# EasyEDA Pro project MSDRV4.eprj, schematic MAX2831_2024_REUSE
Board Name: MAX2831_2024_REUSE; Create Date: 2025-01-27; Page Name: P1; Project Name: MSDRV4; Schematic Name: MAX2831_2024_REUSE; Update Date: 2025-01-27; Company: EasyEDA.com; Page Size: A4; Version: V1.0
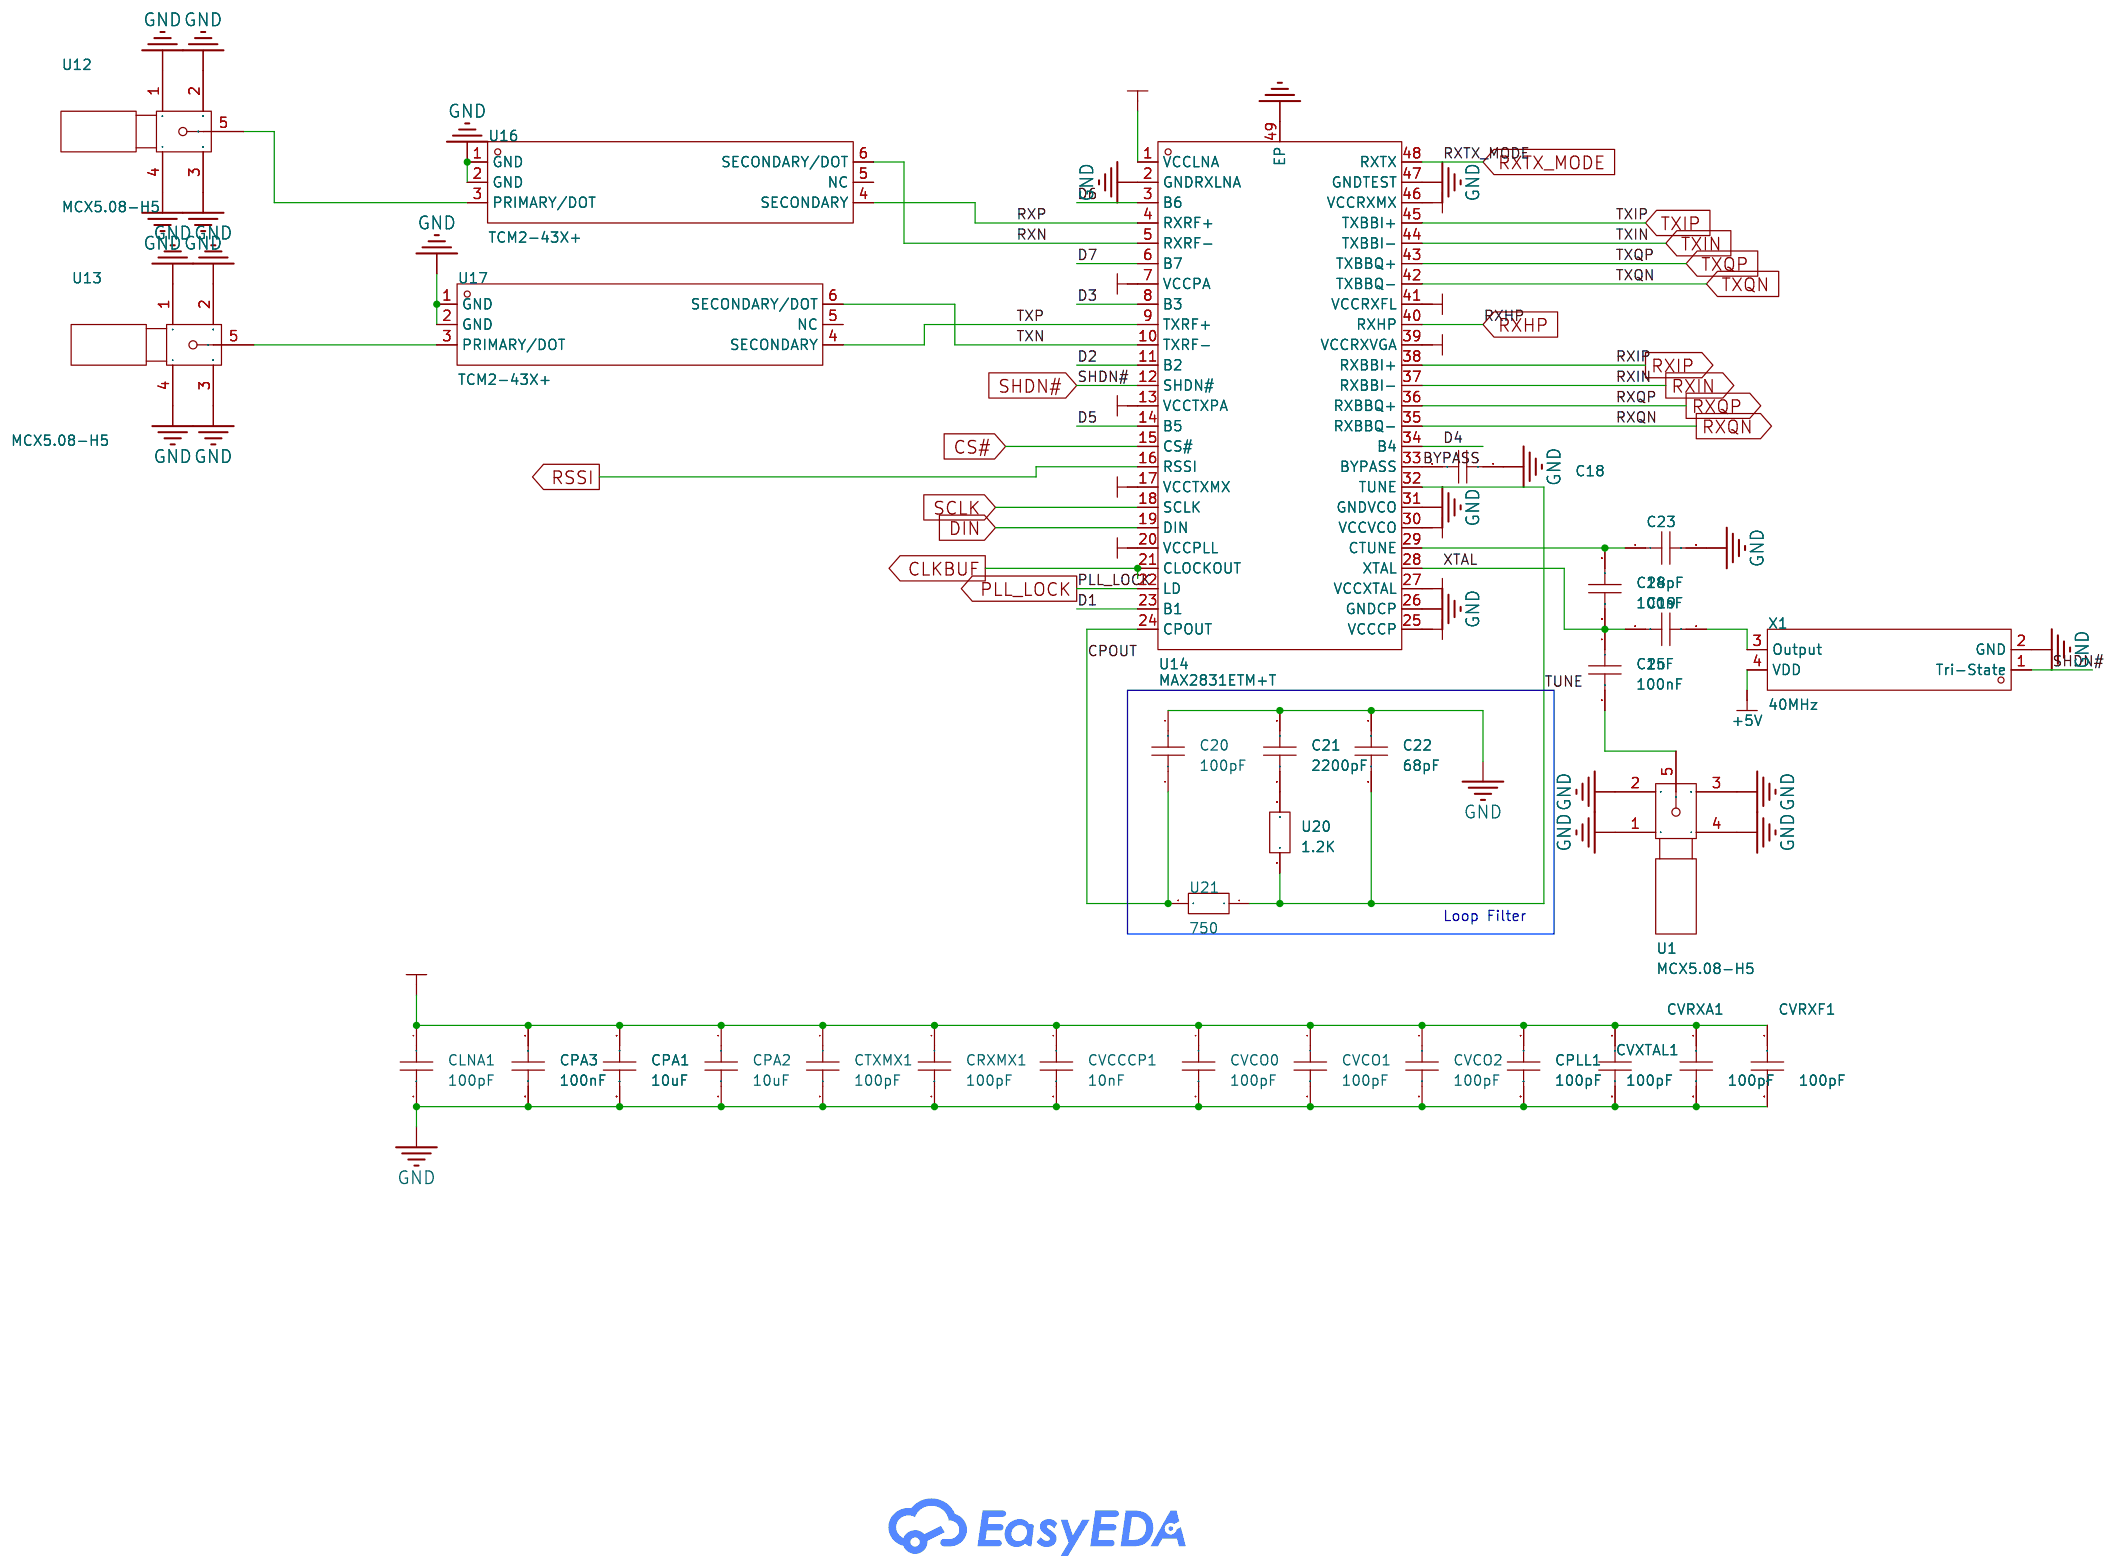
[diagram p2: schematic sheet]

## Parts
C18  100nF  [C0805]
C19  1nF  [C0805]
C20  100pF  [C0805]
C21  2200pF  [C0805]
C22  68pF  [C0805]
C23  18pF  [C0805]
C24  100nF  [C0805]
C25  100nF  [C0805]
CLNA1  100pF  [C0805]
CPA1  10uF  [C0805]
CPA2  10uF  [C0805]
CPA3  100nF  [C0805]
CPLL1  100pF  [C0805]
CRXMX1  100pF  [C0805]
CTXMX1  100pF  [C0805]
CVCCCP1  10nF  [C0805]
CVCO0  100pF  [C0805]
CVCO1  100pF  [C0805]
CVCO2  100pF  [C0805]
CVRXA1  100pF  [C0805]
CVRXF1  100pF  [C0805]
CVXTAL1  100pF  [C0805]
U1  MCX5.08-H5  [SMA-TH_MCX5.08-H5]
U12  MCX5.08-H5  [SMA-TH_MCX5.08-H5]
U13  MCX5.08-H5  [SMA-TH_MCX5.08-H5]
U14  MAX2831ETM+T  [TQFN-48_L7.0-W7.0-P0.50-TL-EP5.6]
U16  TCM2-43X+  [IND-SMD_6P-L4.1-W3.8-P1.27-TL]
U17  TCM2-43X+  [IND-SMD_6P-L4.1-W3.8-P1.27-TL]
U20  1.2K  [R0805]
U21  750  [R0805]
X1  40MHz  [OSC-SMD_4P-L3.2-W2.5-BL]

## Library data of the parts
C18-C23 CLNA1 CPA1-CPA3 CPLL1 CRXMX1 CTXMX1 CVCCCP1 CVCO0-CVCO2 CVRXA1 CVRXF1 CVXTAL1 = CAP_0603: Supplier Footprint: 0603
C24 C25 = CAP_0805: Supplier Footprint: 0805
U1 U12 U13 = MCX5.08-H5_C9900009324: Supplier Part: C9900009324; Supplier Footprint: COAX-F; JLCPCB Part Class: Extended Part; Supplier: LCSC
U14 = MAX2831ETM+T: Frequency Range:2.4GHz Frequency Range:2.4GHz Interface:SPI Operating Voltage:2.7V~3.6V Operating Voltage:2.7V~3.6V Applications:WiFi Output Power:21dBm Data Rate:54Mbps Current Of Transmitting:82mA Sensitivity:-76dBm Receive Current:62mA Operating Temper; Supplier Part: C2152047; Manufacturer: ADI(亚德诺)/MAXIM(美信); Supplier Footprint: TQFN-48-EP(7x7); JLCPCB Part Class: Extended Part; Datasheet: https://atta.szlcsc.com/upload/public/pdf/source/20210601/D5E13A4F591163B65DE03F91E5182685.pdf; Supplier: LCSC; Frequency Range: 2.4GHz; Interface: SPI; Operating Voltage: 2.7V~3.6V; Applications: WiFi; Output Power: 21dBm; Data Rate: 54Mbps; Current Of Transmitting: 82mA; Sensitivity: -76dBm; Receive Current: 62mA; Operating Temperature: -40℃~+85℃
U16 U17 = TCM2-43X+: Frequency Range:10MHz~4GHz Frequency Range:10MHz~4GHz Impedance Ratio-Unbalanced/Balanced:1:2 Insertion Loss (Max):3dB Phase Balance:7° Return Loss (Min):14.98dB; LCSC Part Name: 射频变压器; Supplier Part: C2885644; Manufacturer: Mini-Circuits; Supplier Footprint: SMD-6P; JLCPCB Part Class: Extended Part; Datasheet: https://atta.szlcsc.com/upload/public/pdf/source/20210825/C2885644_24D8D5254C12C7AF6CFE8387515C0B6D.pdf; Supplier: LCSC; Frequency Range: 10MHz~4GHz; Impedance Ratio-Unbalanced/Balanced: 1:2; Insertion Loss (Max): 3dB; Phase Balance: 7°; Return Loss (Min): 14.98dB
U20 U21 = SCR0805J1M: Type:Thick Film Resistors Resistance:1MΩ Tolerance:±5% Tolerance:±5% Power(Watts): Overload Voltage (Max): Operating Temperature Range:-55℃~+155℃ Operating Temperature Range:-55℃~+155℃; LCSC Part Name: 1MΩ ±5%; Supplier Part: C5140152; Manufacturer: VO(翔胜); Supplier Footprint: 0805; JLCPCB Part Class: Extended Part; Datasheet: https://atta.szlcsc.com/upload/public/pdf/source/20220823/E5DDB4243192CD3C8AE9677163F934FF.pdf; Supplier: LCSC; Type: Thick Film Resistors; Tolerance: ±5%; Operating Temperature Range: -55℃~+155℃
X1 = SX3M40.000E20F30THN: Frequency:40MHz Normal temperature Frequency Tolerance:±20ppm Normal temperature Frequency Tolerance:±20ppm Output Type:CMOS Supply Voltage:1.2V Supply Voltage:1.2V Supply Current (Max):2mA Frequency Stability:±30ppm Frequency Stability:±30ppm Operating T; LCSC Part Name: 40MHz ±20ppm 1.2V CMOS; Supplier Part: C5137265; Manufacturer: SCTF(星通时频); Supplier Footprint: SMD3225-4P; JLCPCB Part Class: Extended Part; Datasheet: https://atta.szlcsc.com/upload/public/pdf/source/20240614/033A047EF017DF3AA642F42E2CA84B17.pdf; Supplier: LCSC; Normal temperature Frequency Tolerance: ±20ppm; Output Type: CMOS; Supply Voltage: 1.2V; Supply Current (Max): 2mA; Frequency Stability: ±30ppm; Operating Temperature: -40℃~+85℃

## Nets
+5V: X1.4(VDD)
GND: C18.1 C20.1 C21.1 C22.1 C23.2 CLNA1.2 CPA1.2 CPA2.2 CPA3.2 CPLL1.2 CRXMX1.2 CTXMX1.2 CVCCCP1.2 CVCO0.2 CVCO1.2 CVCO2.2 CVRXA1.2 CVRXF1.2 CVXTAL1.2 U1.1 U1.2 U1.3 U1.4 U12.1 U12.2 U12.3 U12.4 U13.1 U13.2 U13.3 U13.4 U14.2(GNDRXLNA) U14.26(GNDCP) U14.31(GNDVCO) U14.47(GNDTEST) U14.49(EP) U16.1(GND) U16.2(GND) U17.1(GND) U17.2(GND) X1.2(GND)
3.3: CLNA1.1 CPA1.1 CPA2.1 CPA3.1 CPLL1.1 CRXMX1.1 CTXMX1.1 CVCCCP1.1 CVCO0.1 CVCO1.1 CVCO2.1 CVRXA1.1 CVRXF1.1 CVXTAL1.1 U14.1(VCCLNA) U14.7(VCCPA) U14.13(VCCTXPA) U14.17(VCCTXMX) U14.20(VCCPLL) U14.25(VCCCP) U14.27(VCCXTAL) U14.30(VCCVCO) U14.39(VCCRXVGA) U14.41(VCCRXFL) U14.46(VCCRXMX)
BYPASS: C18.2 U14.33(BYPASS)
CLKBUF: U14.21(CLOCKOUT)
CPOUT: C20.2 U14.24(CPOUT) U21.2
CS#: U14.15(CS#)
D1: U14.23(B1)
D2: U14.11(B2)
D3: U14.8(B3)
D4: U14.34(B4)
D5: U14.14(B5)
D6: U14.3(B6)
D7: U14.6(B7)
DIN: U14.19(DIN)
PLL_LOCK: U14.22(LD)
RSSI: U14.16(RSSI)
RXHP: U14.40(RXHP)
RXIN: U14.37(RXBBI-)
RXIP: U14.38(RXBBI+)
RXN: U14.5(RXRF-) U16.6(SECONDARY/DOT)
RXP: U14.4(RXRF+) U16.4(SECONDARY)
RXQN: U14.35(RXBBQ-)
RXQP: U14.36(RXBBQ+)
RXTX_MODE: U14.48(RXTX)
SCLK: U14.18(SCLK)
SHDN#: U14.12(SHDN#) X1.1(Tri-State)
TUNE: C22.2 U14.32(TUNE) U20.1 U21.1
TXIN: U14.44(TXBBI-)
TXIP: U14.45(TXBBI+)
TXN: U14.10(TXRF-) U17.6(SECONDARY/DOT)
TXP: U14.9(TXRF+) U17.4(SECONDARY)
TXQN: U14.42(TXBBQ-)
TXQP: U14.43(TXBBQ+)
XTAL: C19.2 C24.2 C25.1 U14.28(XTAL)
$1I297\$1N2490: C19.1 X1.3(Output)
Net-(C21-2): C21.2 U20.2
Net-(C23-1): C23.1 C24.1 U14.29(CTUNE)
Net-(C25-2): C25.2 U1.5
Net-(U12-5): U12.5 U16.3(PRIMARY/DOT)
Net-(U13-5): U13.5 U17.3(PRIMARY/DOT)

Not connected (* = marked no-connect by the designer): U16 5(NC); U17 5(NC)

## Notes on the sheet
- Loop Filter
